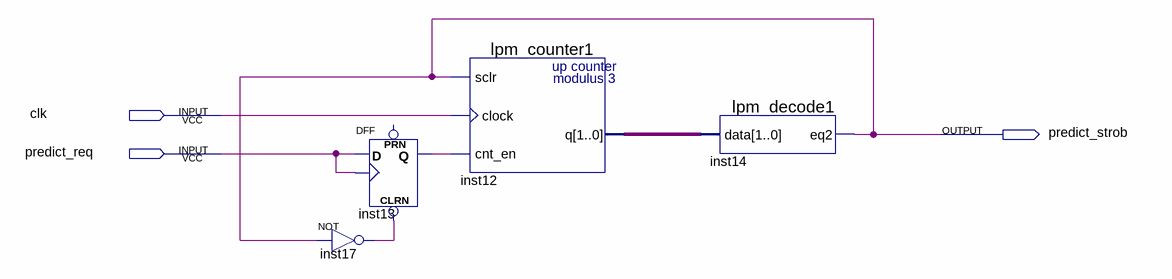
[diagram p0: schematic sheet]
// Quartus schematic SLEEP.bdf as structural Verilog: 4 symbols, 3 pins
module SLEEP (
  input  clk,
  input  predict_req,
  output predict_strob
);

  wire inst13_q, inst17_out;
  wire [1:0] inst12_q;

  not inst17 (inst17_out, predict_strob);
  DFF inst13 (.CLRN(inst17_out), .CLK(predict_req), .D(predict_req), .Q(inst13_q));  // open: PRN
  lpm_counter1 inst12 (.sclr(predict_strob), .clock(clk), .cnt_en(inst13_q), .q(inst12_q));
  lpm_decode1 inst14 (.data(inst12_q), .eq2(predict_strob));
endmodule
